# EAGLE design MDeckProgrammer (EAGLE 9.0.0)
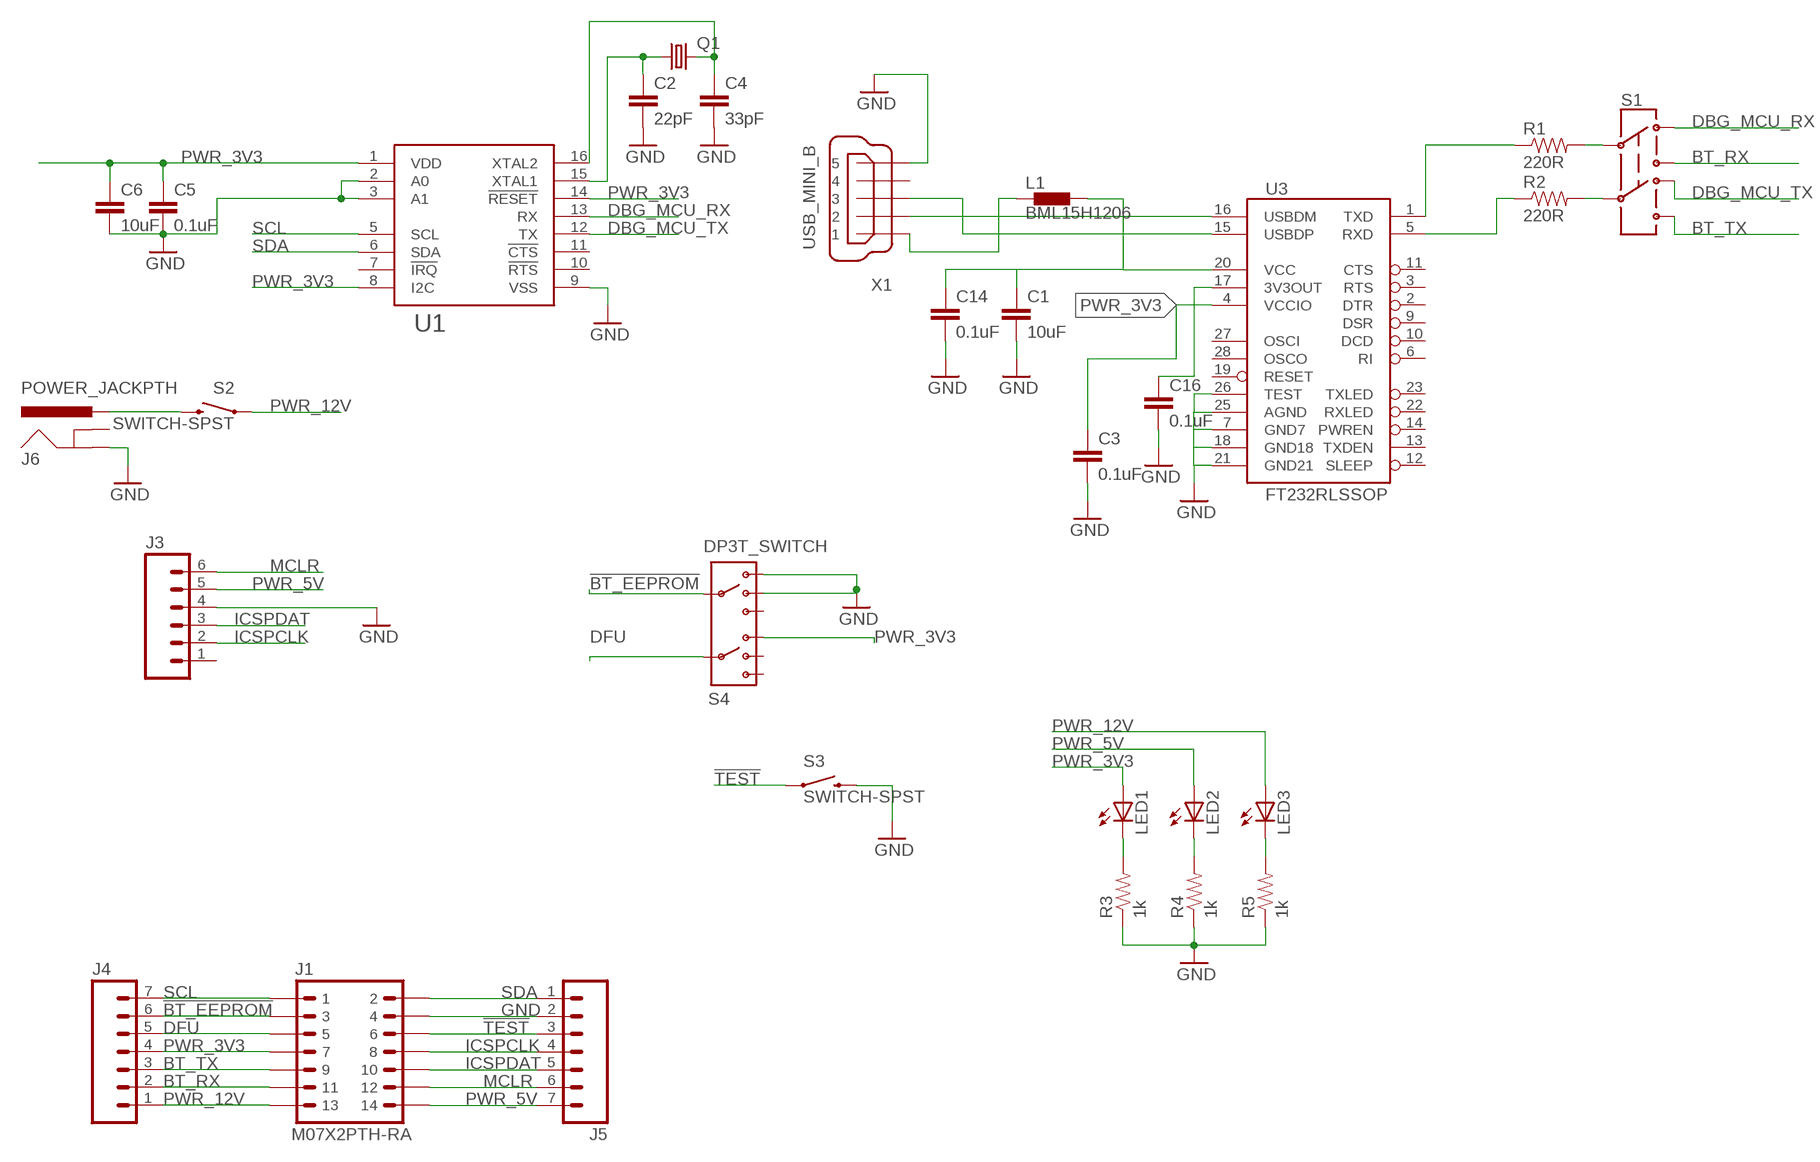
[diagram p0: schematic, sheet 1]

## Parts
C1  10uF  CAP1206  [1206]
C2  22pF  CAP1206  [1206]
C3  0.1uF  CAP1206  [1206]
C4  33pF  CAP1206  [1206]
C5  0.1uF  CAP1206  [1206]
C6  10uF  CAP1206  [1206]
C14  0.1uF  CAP1206  [1206]
C16  0.1uF  CAP1206  [1206]
J1  M07X2PTH-RA  [JST-14-PUD-PTH]
J3  M06HARWIN_RA  [1X06_RA]
J4  M07  [1X07]
J5  M07  [1X07]
J6  POWER_JACKPTH  [POWER_JACK_PTH]
L1  BML15H1206  [1206]
LED1  LEDCHIPLED_1206  [CHIPLED_1206]
LED2  LEDCHIPLED_1206  [CHIPLED_1206]
LED3  LEDCHIPLED_1206  [CHIPLED_1206]
Q1  CRYSTALHC49S  [HC49/S]
R1  220R  RESISTOR1206  [1206]
R2  220R  RESISTOR1206  [1206]
R3  1k  RESISTOR1206  [1206]
R4  1k  RESISTOR1206  [1206]
R5  1k  RESISTOR1206  [1206]
S1  SWITCH-DPDTPTH  [MSS22]
S2  SWITCH-SPST  [GF-123-0054]
S3  SWITCH-SPST  [GF-123-0054]
S4  DP3T_SWITCH  [EG2301A]
U1  SC16IS740TSSOP16  [TSSOP16]
U3  FT232RLSSOP  [SSOP28DB]
X1  USB_MINI_B  [USB_MINI_B_PTH]

## Nets
!BT_EEPROM: J1.P$3 J4.6 S4.P$3(COMA)
!TEST: J1.P$6 J5.3 S3.P$1
BT_RX: J1.P$11 J4.2 S1.3
BT_TX: J1.P$9 J4.3 S1.6
DBG_MCU_RX: S1.1 U1.13(RX)
DBG_MCU_TX: S1.4 U1.12(TX)
DFU: J1.P$5 J4.5 S4.P$7(COMB)
GND: C1.2 C2.2 C3.2 C4.2 C5.2 C6.2 C14.2 C16.2 J1.P$4 J3.4 J5.2 J6.GND R3.1 R4.1 R5.1 S3.P$2 S4.P$1(A1) S4.P$2(A2) U1.2(A0) U1.3(A1) U1.9(VSS) U3.7(GND7) U3.18(GND18) U3.21(GND21) U3.25(AGND) U3.26(TEST) X1.5
ICSPCLK: J1.P$8 J3.2 J5.4
ICSPDAT: J1.P$10 J3.3 J5.5
MCLR: J1.P$12 J3.6 J5.6
N$1: R1.2 S1.2
N$2: R2.2 S1.5
N$3: C2.1 Q1.1 U1.15(XTAL1)
N$4: C4.1 Q1.2 U1.16(XTAL2)
N$5: J6.PWR S2.P$2
N$6: R1.1 U3.1(TXD)
N$7: R2.1 U3.5(RXD)
N$8: U3.15(USBDP) X1.3
N$9: U3.16(USBDM) X1.2
N$10: LED1.C R3.2
N$11: L1.1 X1.1
N$12: C1.1 C14.1 L1.2 U3.20(VCC)
N$13: LED2.C R4.2
N$14: C16.1 U3.17(3V3OUT)
N$15: LED3.C R5.2
PWR_3V3: C3.1 C5.1 C6.1 J1.P$7 J4.4 LED1.A S4.P$5(B1) U1.1(VDD) U1.8(I2C) U1.14(!RESET) U3.4(VCCIO)
PWR_5V: J1.P$14 J3.5 J5.7 LED2.A
PWR_12V: J1.P$13 J4.1 LED3.A S2.P$1
SCL: J1.P$1 J4.7 U1.5(SCL)
SDA: J1.P$2 J5.1 U1.6(SDA)
Unconnected: J3.1 J6.GNDBREAK S4.P$4(A3) S4.P$6(B2) S4.P$8(B3) U1.7(!IRQ) U1.10(!RTS) U1.11(!CTS) U3.2(DTR) U3.3(RTS) U3.6(RI) U3.9(DSR) U3.10(DCD) U3.11(CTS) U3.12(SLEEP) U3.13(TXDEN) U3.14(PWREN) U3.19(RESET) U3.22(RXLED) U3.23(TXLED) U3.27(OSCI) U3.28(OSCO) X1.4

## Library data of the parts
C1-C6 C14 C16 = spareparts:CAP: Capacitor Standard 0603 ceramic capacitor, and 0.1" leaded capacitor.
J1 = spareparts:M07X2: 14 pin 2 row 2mm pitch JST PUD series connector; DIGI_PN: 455-2488-ND; MFN: JST Sales America Inc.; MFP: S14B-PUDSS-1(LF)(SN)
J3 = spareparts:M06: Header 6 Standard 6-pin 0.1" header. Use with straight break away headers (SKU : PRT-00116), right angle break away headers (PRT-00553), swiss pins (PRT-00743), machine pins (PRT-00117), and female headers (PRT-00115). Molex polarized connector foot print use with SKU : PRT-08094 with associated crimp pins and housings. NOTES ON THE VARIANTS LOCK and LOCK_LONGPADS... This footprint was designed to help hold the alignment of a through-hole component (i.e. 6-pin header) while soldering it into place. You may notice that each hole has been shifted either up or down by 0.005 of an inch from it's more standard position (which is a perfectly straight line). This slight alteration caused the pins (the squares in the middle) to touch the edges of the holes. Because they are alternating, it causes a "brace" to hold the component in place. 0.005 has proven to be the perfect amount of "off-center" position when using our standard breakaway headers. Although looks a little odd when you look at the bare footprint, once you have a header in there, the alteration is very hard to notice. Also,if you push a header all the way into place, it is covered up entirely on the bottom side. This idea of altering the position of holes to aid alignment will be further integrated into the Sparkfun Library for other footprints. It can help hold any component with 3 or more connection pins.; DIGI_PN: 952-2247-ND; MFN: Harwin Inc.; MFP: M20-9960645
J4 J5 = spareparts:M07: Header 7 Standard 7-pin 0.1" header. Use with straight break away headers (SKU : PRT-00116), right angle break away headers (PRT-00553), swiss pins (PRT-00743), machine pins (PRT-00117), and female headers (PRT-00115). NOTES ON THE VARIANTS LOCK and LOCK_LONGPADS... This footprint was designed to help hold the alignment of a through-hole component (i.e. 7-pin header) while soldering it into place. You may notice that each hole has been shifted either up or down by 0.005 of an inch from it's more standard position (which is usually a perfectly straight line). This slight alteration caused the pins (the squares in the middle) to touch the edges of the holes. Because they are alternating, it causes a "brace" to hold the header in place. 0.005 has proven to be the perfect amount of "off-center" position when using our standard breakaway headers. Although looks a little odd when you look at the bare footprint, once you have a header in there, the alteration is very hard to notice. Also, if you push a header all the way into place, it is covered up entirely on the bottom side. This idea of altering the position of holes to aid alignment will be further integrated into the Sparkfun Library for other footprints. It can help hold any component with 3 or more connection pins.
J6 = SparkFun-Connectors:POWER_JACK: Power Jack This is the standard 5.5mm barrel jack for power. The PTH is the most common, proven, reliable, footprint. The Slot footprint only works if the mill layer is transmitted to the PCB fab house so be warned. Mating wall wart : TOL-00298 (and others); DIGI_PN: CP-102AH-ND; MFN: CUI Inc.; MFP: PJ-102AH; PROD_ID: CONN-08197
L1 = spareparts:BML15H: EMIFIL (R) Chip Ferrite Bead for GHz Noise Source: http://www.murata.com/ Ferrite Bead BLM15H.pdf
LED1-LED3 = adafruit:LED: LED OSRAM: - CHIPLED LG R971, LG N971, LY N971, LG Q971, LY Q971, LO R971, LY R971 LH N974, LH R974 LS Q976, LO Q976, LY Q976 LO Q996 - Hyper CHIPLED LW Q18S LB Q993, LB Q99A, LB R99A - SideLED LS A670, LO A670, LY A670, LG A670, LP A670 LB A673, LV A673, LT A673, LW A673 LH A674 LY A675 LS A676, LA A676, LO A676, LY A676, LW A676 LS A679, LY A679, LG A679 - Hyper Micro SIDELED® LS Y876, LA Y876, LO Y876, LY Y876 LT Y87S - SmartLED LW L88C, LW L88S LB L89C, LB L89S, LG L890 LS L89K, LO L89K, LY L89K LS L896, LA L896, LO L896, LY L896 - TOPLED LS T670, LO T670, LY T670, LG T670, LP T670 LSG T670, LSP T670, LSY T670, LOP T670, LYG T670 LG T671, LOG T671, LSG T671 LB T673, LV T673, LT T673, LW T673 LH T674 LS T676, LA T676, LO T676, LY T676, LB T676, LH T676, LSB T676, LW T676 LB T67C, LV T67C, LT T67C, LS T67K, LO T67K, LY T67K, LW E67C LS E67B, LA E67B, LO E67B, LY E67B, LB E67C, LV E67C, LT E67C LW T67C LS T679, LY T679, LG T679 LS T770, LO T770, LY T770, LG T770, LP T770 LB T773, LV T773, LT T773, LW T773 LH T774 LS E675, LA E675, LY E675, LS T675 LS T776, LA T776, LO T776, LY T776, LB T776 LHGB T686 LT T68C, LB T68C - Hyper Mini TOPLED® LB M676 - Mini TOPLED Santana® LG M470 LS M47K, LO M47K, LY M47K Source: http://www.osram.convergy.de/
Q1 = crystal:CRYSTAL: CRYSTAL; OC_FARNELL: 1667008; OC_NEWARK: unknown
R1-R5 = spareparts:RESISTOR: Resistor Basic schematic elements and footprints for 0603, 1206, and PTH resistors.
S1 = SparkFun-Electromechanical:SWITCH-DPDT: DPDT Version of the COM-00597; DIGI_PN: 450-1589-ND; MFN: TE Connectivity ALCOSWITCH Switches; MFP: 1825263-1
S2 S3 = spareparts:SWITCH-SPST: SPST Switch; DIGI_PN: CWI333-ND; MFN: CW Industries; MFP: GF-123-0054
S4 = spareparts:DP3T_SWITCH: DP3T Switch; DIGI_PN: EG1944-ND; MFN: E-Switch; MFP: EG2301A
U1 = spareparts:SC16IS740: NXP SC16IS740 I2C/SPI to UART bridge; DIGI_PN: 568-3648-5-ND; MFN: NXP USA Inc.; MFP: SC16IS740IPW,112
U3 = SparkFun-DigitalIC:FT232RL: USB UART FT232RL 4th Generation USB UART (USB <-> Serial) Controller. Spark Fun Electronics SKU : COM-00650 Production SKU IC-00870; DIGI_PN: 768-1306-ND; MFN: FTDI, Future Technology Devices International Ltd; MFP: FT232RL-TUBE; PROD_ID: IC-00870
X1 = spareparts:USB_MINI_B: USB Mini B connector; DIGI_PN: A135698-ND; MFN: TE Connectivity AMP Connectors; MFP: 2172034-1

## Board
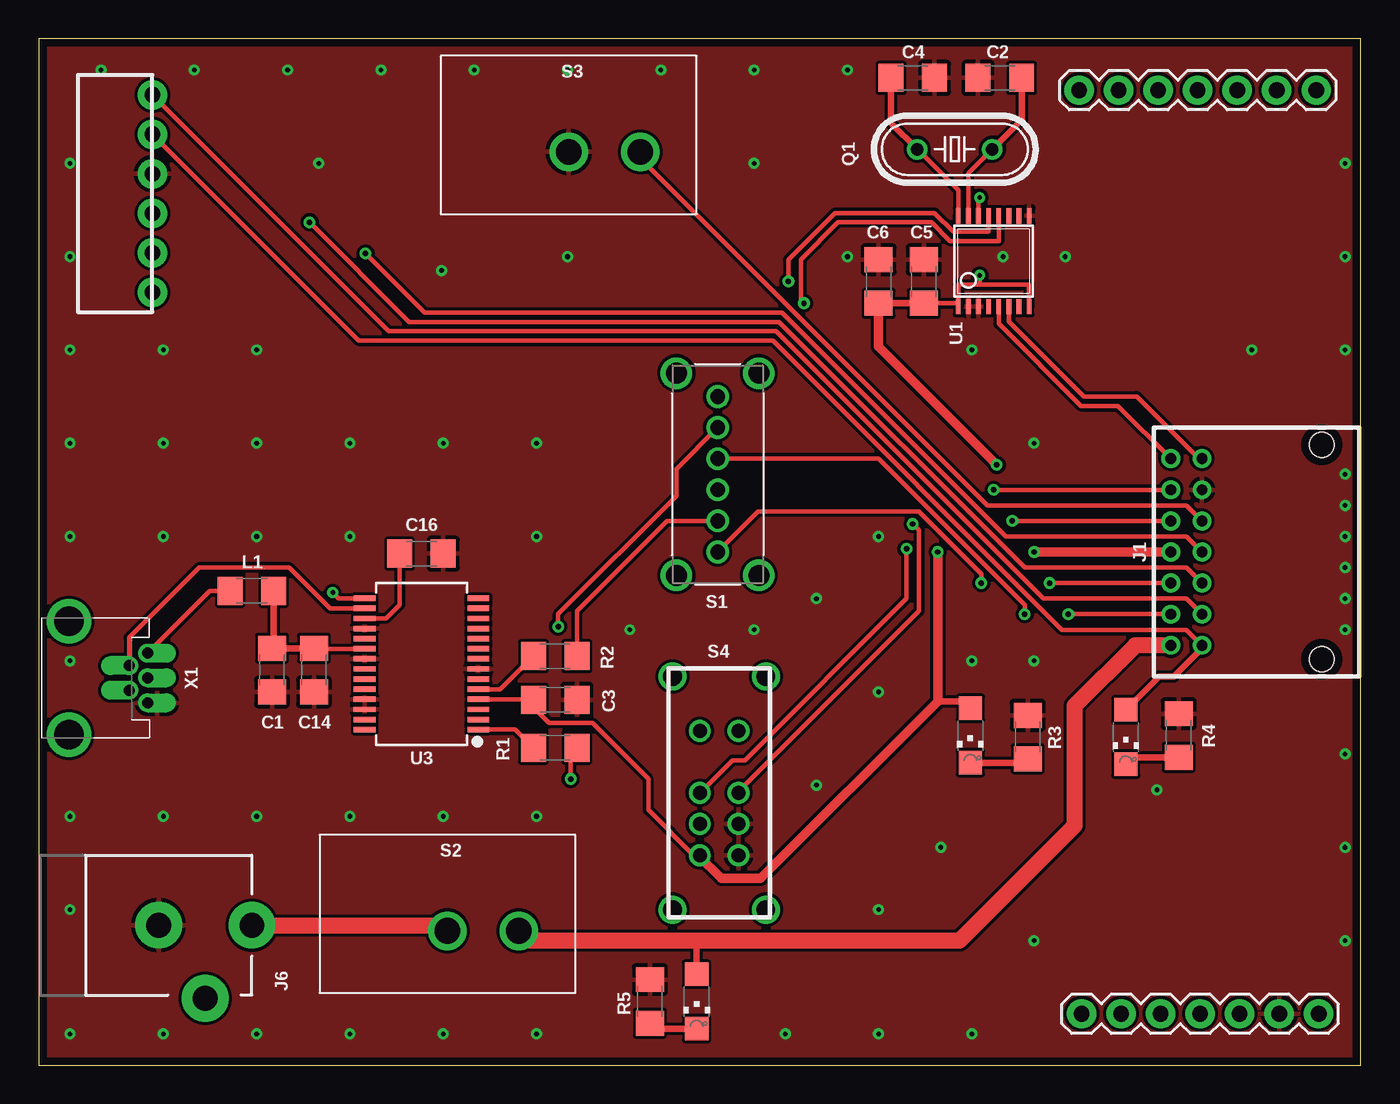
[diagram p1: board, top side]
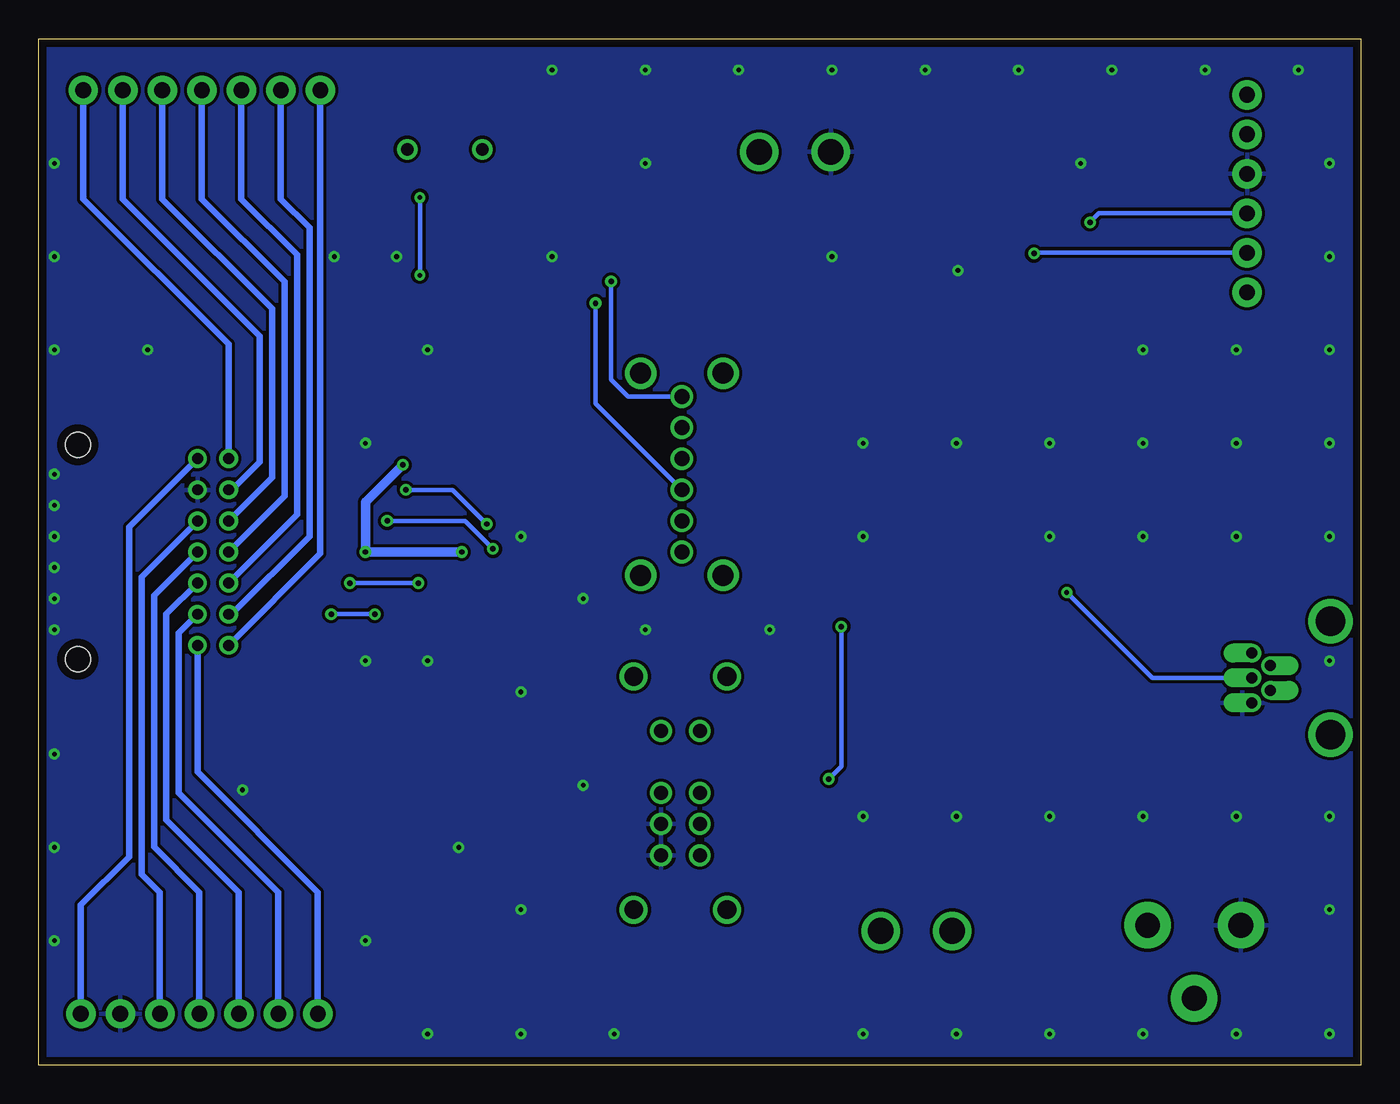
[diagram p2: board, bottom side, seen from below]

Size 85 x 66 mm. Coordinates in mm from the lower left corner, seen from the top.
Outline: 0,0 85,0 85,66 0,66 0,0
Copper layers (1*16): Top 0.035mm / dielectric 1.5mm / Bottom 0.035mm
Design rules "default *": minimum track width 6mil, minimum drill 0.3mm, track to track 6mil, track to pad 6mil, pad to pad 6mil, via to via 6mil, smd to smd 6mil, copper to edge 20mil, drill to drill 6mil, minimum pad ring 10mil, minimum via ring 8mil, stop-mask expansion 4mil, vias tented up to drill 17mil, thermal gap 10mil
tKeepout: area -15,36 to 2,76; area -15,19.9 to 0,30.1

### Footprints (pad centres in the part's own frame; a part is rotated, then mirrored left to right if it is on the bottom)
1206 = smd 1.6 x 1.8: 1 -1.4,0; 2 1.4,0
JST-14-PUD-PTH = drill 0.7: P$1 0,1; P$2 0,3; P$3 2,1; P$4 2,3; P$5 4,1; P$6 4,3; P$7 6,1; P$8 6,3; P$9 8,1; P$10 8,3; P$11 10,1; P$12 10,3; P$13 12,1; P$14 12,3 | hole 1.6: -0.9,10.7; 12.9,10.7
1X06_RA = drill 1.016 pad 1.88: 1 0,0; 2 2.54,0; 3 5.08,0; 4 7.62,0; 5 10.16,0; 6 12.7,0
1X07 = drill 1.016 pad 1.88: 1 0,0; 2 2.54,0; 3 5.08,0; 4 7.62,0; 5 10.16,0; 6 12.7,0; 7 15.24,0
POWER_JACK_PTH = drill 1.6 pad 3: GND 0,7.7; GNDBREAK 4.7,10.7; PWR 0,13.7
CHIPLED_1206 = smd 1.5 x 1.5: A 0,-1.75; C 0,1.75
HC49/S = drill 0.813: 1 -2.413,0; 2 2.413,0
MSS22 = drill 0.95: 1 2.65,11.5; 2 2.65,9.5; 3 2.65,7.5; 4 2.65,5.5; 5 2.65,3.5; 6 2.65,1.5 | drill 1.35: NC@1 0,13; NC@2 5.3,13; NC@3 0,0; NC@4 5.3,0
GF-123-0054 = drill 1.65: P$1 -4.37,2.17; P$2 0.23,2.17
EG2301A = drill 0.9: P$1 4,2; P$2 6,2; P$3 8,2; P$4 12,2; P$5 4,4.5; P$6 6,4.5; P$7 8,4.5; P$8 12,4.5 | drill 1.2: P$9 0.5,0.25; P$10 15.5,0.25; P$11 0.5,6.25; P$12 15.5,6.25
TSSOP16 = smd 0.305 x 0.991: 1 -2.275,-2.918; 2 -1.625,-2.918; 3 -0.975,-2.918; 4 -0.325,-2.918; 5 0.325,-2.918; 6 0.975,-2.918; 7 1.625,-2.918; 8 2.275,-2.918; 9 2.275,2.918; 10 1.625,2.918; 11 0.975,2.918; 12 0.325,2.918; 13 -0.325,2.918; 14 -0.975,2.918; 15 -1.625,2.918; 16 -2.275,2.918
SSOP28DB = smd 0.348 x 1.397: 1 -4.225,-3.656; 2 -3.575,-3.656; 3 -2.925,-3.656; 4 -2.275,-3.656; 5 -1.625,-3.656; 6 -0.975,-3.656; 7 -0.325,-3.656; 8 0.325,-3.656; 9 0.975,-3.656; 10 1.625,-3.656; 11 2.275,-3.656; 12 2.925,-3.656; 13 3.575,-3.656; 14 4.225,-3.656; 15 4.225,3.656; 16 3.575,3.656; 17 2.925,3.656; 18 2.275,3.656; 19 1.625,3.656; 20 0.975,3.656; 21 0.325,3.656; 22 -0.325,3.656; 23 -0.975,3.656; 24 -1.625,3.656; 25 -2.275,3.656; 26 -2.925,3.656; 27 -3.575,3.656; 28 -4.225,3.656
USB_MINI_B_PTH = drill 0.7 pad 1.016 offset: 1 4.095,1.6; 2 2.905,0.8; 3 4.095,0; 4 2.905,-0.8; 5 4.095,-1.6 | drill 1.9: M1 -0.955,3.65; M2 -0.955,-3.65

### Placement (x,y rotation side)
C1  15,25.4 270 top
C2  61.8,63.5 180 top
C3  33.2,23.5 0 top
C4  56.2,63.5 0 top
C5  56.9,50.4 90 top
C6  54,50.4 90 top
C14  17.7,25.4 270 top
C16  24.6,32.9 0 top
J1  71.8,39 270 top
J3  7.3,49.7 90 top
J4  66.9,62.7 0 top
J5  82.3,3.3 180 top
J6  0,9 270 top
L1  13.7,30.5 0 top
LED1  59.9,21.2 180 top
LED2  69.9,21.1 180 top
LED3  42.3,4.1 180 top
Q1  58.9,58.9 180 top
R1  33.2,20.4 0 top
R2  33.2,26.3 0 top
R3  63.6,21.1 270 top
R4  73.3,21.2 270 top
R5  39.3,4.1 270 top
S1  41,31.5 0 top
S2  26.5,10.8 180 top
S3  34.3,60.9 180 top
S4  47,9.5 90 top
U1  61.4,51.7 0 top
U3  24.6,25.8 90 top
X1  2.9,24.9 0 top

### Tracks (layer width: path | path; a pad name or v marks a point on that pad's centre or on a via)
!BT_EEPROM  (via drill 0.35)
  Top 0.305: J1.P$3 v61.4,37 | v56.2,34.8 56.6,34.4 56.6,29.2 45,17.6 S4.P$3
  Bottom 0.305: v61.4,37 58.4,37 v56.2,34.8
  Bottom 0.406: J1.P$3 72.6,37 70.8,38.8 70.8,46.9 79.6,55.7 J4.6
!TEST
  Top 0.305: J1.P$6 73.8,36 61,36 38.67,58.33 S3.P$1
  Bottom 0.406: J1.P$6 78.4,31.4 78.4,12.28 77.22,11.1 J5.3
BT_RX  (via drill 0.35)
  Top 0.305: v63.4,29 63.4,29.6 54,39 S1.3 | v66.2,29 J1.P$11
  Bottom 0.305: v63.4,29 v66.2,29
  Bottom 0.406: J1.P$11 72.6,29 67.6,34 67.6,53.86 69.44,55.7 J4.2
BT_TX  (via drill 0.35)
  Top 0.305: v65,31 J1.P$9 | v60.6,31 60.6,31.6 56.6,35.6 46.25,35.6 S1.6
  Bottom 0.305: v60.6,31 v65,31
  Bottom 0.406: J1.P$9 68.4,35.4 68.4,52.12 71.98,55.7 J4.3
DBG_MCU_RX  (via drill 0.35)
  Top 0.305: U1.13 61.08,53.6 58.8,53.6 57.6,54.8 51.2,54.8 48.2,51.8 v48.2,50.4
  Bottom 0.305: v48.2,50.4 48.2,44.1 47.1,43 S1.1
DBG_MCU_TX  (via drill 0.35)
  Top 0.305: U1.12 61.73,53 58.6,53 57.4,54.2 51.4,54.2 49,51.8 49,49.2 v49.2,49
  Bottom 0.305: v49.2,49 49.2,42.55 S1.4
DFU  (via drill 0.35)
  Top 0.305: J1.P$5 v62.6,35 | v55.8,33.2 55.8,30 45.4,19.6 44.6,19.6 S4.P$7
  Bottom 0.305: v62.6,35 57.6,35 v55.8,33.2
  Bottom 0.406: J1.P$5 70,37.8 70,48.64 77.06,55.7 J4.5
GND  (via drill 0.3)
  other vias: 2,2 8,2 14,2 20,2 26,2 32,2 48,2 54,2 60,2 64,8 54,10 32,16 26,16 14,16 20,16 8,16 2,16 2,10 50,18 54,24 58,14 71.9,17.7 84,8 84,14 84,20 84,28 84,30 84,32 84,34 84,36 84,38 78,46 84,46 84,52 84,58 66,52 60,46 64,40 64,26 60,26 54,34 50,30 46,28 38,28 32,34 20,34 14,34 8,34 2,34 2,26 2,40 8,40 14,40 20,40 26,40 32,40 14,46 8,46 2,46 2,52 2,58 18,58 25.9,51.1 34,52 52,52 62,52 46,58 52,64 46,64 40,64 34,64 28,64 22,64 16,64 10,64 4,64
  pour Top (isolate 0.2): 0,0 85,0 85,66 0,66
  pour Bottom (isolate 0.2): 0,0 85,0 85,66 0,66
ICSPCLK  (via drill 0.35)
  Top 0.305: v21,52.2 24.8,48.4 47.8,48.4 62.2,34 73.8,34 J1.P$8
  Bottom 0.305: J3.2 20.96,52.24 v21,52.2
  Bottom 0.406: J1.P$8 77.6,30.2 77.6,14.02 74.68,11.1 J5.4
ICSPDAT  (via drill 0.35)
  Top 0.305: v17.4,54.2 23.8,47.8 47.6,47.8 63.4,32 73.8,32 J1.P$10
  Bottom 0.305: J3.3 16.82,54.78 v17.4,54.2
  Bottom 0.406: J1.P$10 76.8,29 76.8,15.76 72.14,11.1 J5.5
MCLR
  Top 0.305: J3.6 22.5,47.2 47.4,47.2 64.6,30 73.8,30 J1.P$12
  Bottom 0.406: J1.P$12 76,27.8 76,17.5 69.6,11.1 J5.6
N$1  (via drill 0.35)
  Top 0.305: R1.2 34.2,19.7 v34.2,18.4 | v33.4,28.2 33.4,29 41,36.6 41,38.35 S1.2
  Bottom 0.305: v33.4,28.2 33.4,19.2 v34.2,18.4
N$2
  Top 0.305: R2.2 34.6,29.2 40.4,35 S1.5
N$3
  Top 0.305: Q1.1 59.77,57.36 U1.15
  Top 0.406: C2.1 63.2,60.79 Q1.1
N$4
  Top 0.305: Q1.2 59.12,56.26 U1.16
  Top 0.406: C4.1 54.8,60.59 Q1.2
N$5
  Top 1.016: J6.PWR 25.9,9 S2.P$2
N$6
  Top 0.305: R1.1 30.62,21.57 U3.1
N$7
  Top 0.305: U3.5 29.68,24.18 R2.1
N$8  (via drill 0.3)
  Top 0.305: v18.9,30.4 19.27,30.02 U3.15
  Bottom 0.305: X1.3 13.4,24.9 v18.9,30.4
N$9
  Top 0.305: U3.16 18.73,29.38 16.1,32 10.3,32 5.8,27.5 X1.2
N$10
  Top 0.406: LED1.C 63.35,19.45 R3.2
N$11
  Top 0.305: L1.1 10.99,30.5 X1.1
N$12
  Top 0.305: C14.1 17.73,26.77 U3.20
  Top 0.406: L1.2 15.1,26.9 C1.1 C14.1
N$13
  Top 0.406: LED2.C 70.35,19.8 R4.2
N$14
  Top 0.305: C16.1 23.2,29.6 22.32,28.73 U3.17
N$15
  Top 0.406: LED3.C 39.65,2.35 R5.2
PWR_3V3  (via drill 0.3, 0.35)
  Top 0.305: U3.4 31.77,23.52 | 31.77,23.52 C3.1 | S4.P$5 42.4,13.5 42.1,13.5 39.2,16.4 39.2,18.4 35.6,22 32.8,22 31.77,23.02 31.77,23.52 | 59.12,49 59.12,50.2 60.5,50.2 | 59.12,49 U1.1 | 60.5,50.2 63.67,50.2 U1.8 | C5.1 59.12,49 | U1.14 60.42,55.52 v60.5,55.8 | v60.5,50.8 60.5,50.2
  Top 0.406: C5.1 C6.1 | LED1.A 59.45,23.4 57.8,23.4
  Top 0.61: J1.P$7 v64,33 | v57.8,33 57.8,23.4 46.4,12 43.9,12 42.4,13.5 | v61.6,38.6 54,46.2 C6.1
  Bottom 0.305: v60.5,55.8 v60.5,50.8
  Bottom 0.406: J1.P$7 69.2,36.6 69.2,50.38 74.52,55.7 J4.4
  Bottom 0.61: v57.8,33 v64,33 64,36.2 v61.6,38.6
PWR_5V
  Top 0.305: J3.5 20.56,46.6 47.2,46.6 65.8,28 73.8,28 J1.P$14
  Top 0.406: LED2.A 72.05,25 73,25 74.8,26.8 J1.P$14
  Bottom 0.406: J1.P$14 74.8,18.84 67.06,11.1 J5.7
PWR_12V
  Top 0.406: LED3.A 42.3,7.7 42,8
  Top 1.016: J1.P$13 70.5,27 66.6,23.1 66.6,15.4 59.2,8 42,8 31.5,8 S2.P$1
  Bottom 0.406: J4.1 66.9,32.9 J1.P$13
SCL
  Top 0.305: U1.5 61.73,47.67 67,42.4 69.4,42.4 J1.P$1
  Bottom 0.406: J1.P$1 72.8,46.36 82.14,55.7 J4.7
SDA
  Top 0.305: U1.6 62.38,47.83 67.2,43 70.6,43 74.6,39 J1.P$2
  Bottom 0.406: J1.P$2 79.2,34.6 79.2,13.4 82.3,10.3 J5.1

### Text on the board
tDocu: Copyright 2018 Cantaloupe Radio LLC | 12V | BT_RX | BT_TX | 3V3 | DFU | !BTEEPROM | SCL | PICKit3 | Normal | !TEST | MDeck Series / Programmer v0.2 | MCU / DEBUG | SERIAL / ENDPOINT | BT / MODULE | NORMAL | 12V POWER | EEPROM | 3V3 | 5V | BT MODE | FLASH | 5V | MCLR | ICSPDAT | ICSPCLK | !TEST | GND | SDA | 12V | OFF | ON